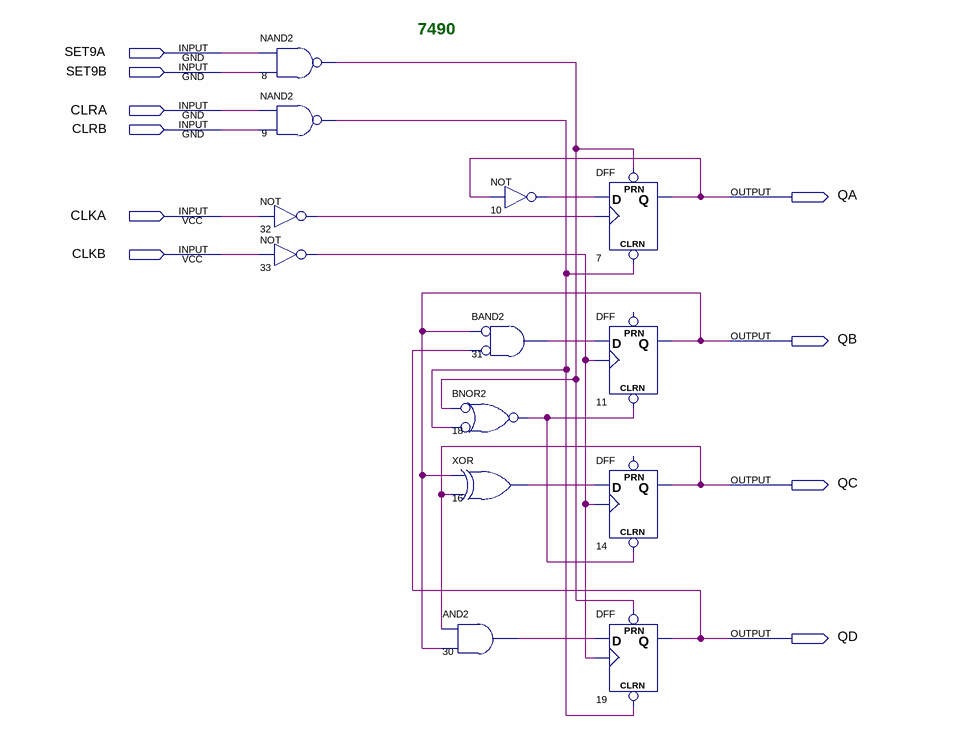
[diagram p0: schematic sheet]
// Quartus schematic 7490.bdf as structural Verilog: 13 symbols, 10 pins
module \7490  (
  input  SET9A,
  input  SET9B,
  input  CLRA,
  input  CLRB,
  input  CLKA,
  input  CLKB,
  output QA,
  output QB,
  output QC,
  output QD
);

  wire n8_out, n9_out, n10_out, n16_out, n18_out, n30_out, n31_out, n32_out, n33_out;

  nand u_8 (n8_out, SET9A, SET9B);
  nand u_9 (n9_out, CLRA, CLRB);
  not u_32 (n32_out, CLKA);
  not u_33 (n33_out, CLKB);
  nor u_18 (n18_out, ~n8_out, ~n9_out);  // BNOR2
  xor u_16 (n16_out, QB, QC);
  and u_30 (n30_out, QC, QB);
  not u_10 (n10_out, QA);
  and u_31 (n31_out, ~QB, ~QD);  // BAND2
  DFF u_7 (.CLRN(n9_out), .CLK(n32_out), .D(n10_out), .PRN(n8_out), .Q(QA));
  DFF u_11 (.CLRN(n18_out), .CLK(n33_out), .D(n31_out), .Q(QB));  // open: PRN
  DFF u_14 (.CLRN(n18_out), .CLK(n33_out), .D(n16_out), .Q(QC));  // open: PRN
  DFF u_19 (.CLRN(n9_out), .CLK(n33_out), .D(n30_out), .PRN(n8_out), .Q(QD));

  // Notes on the sheet:
  //   7490
endmodule
